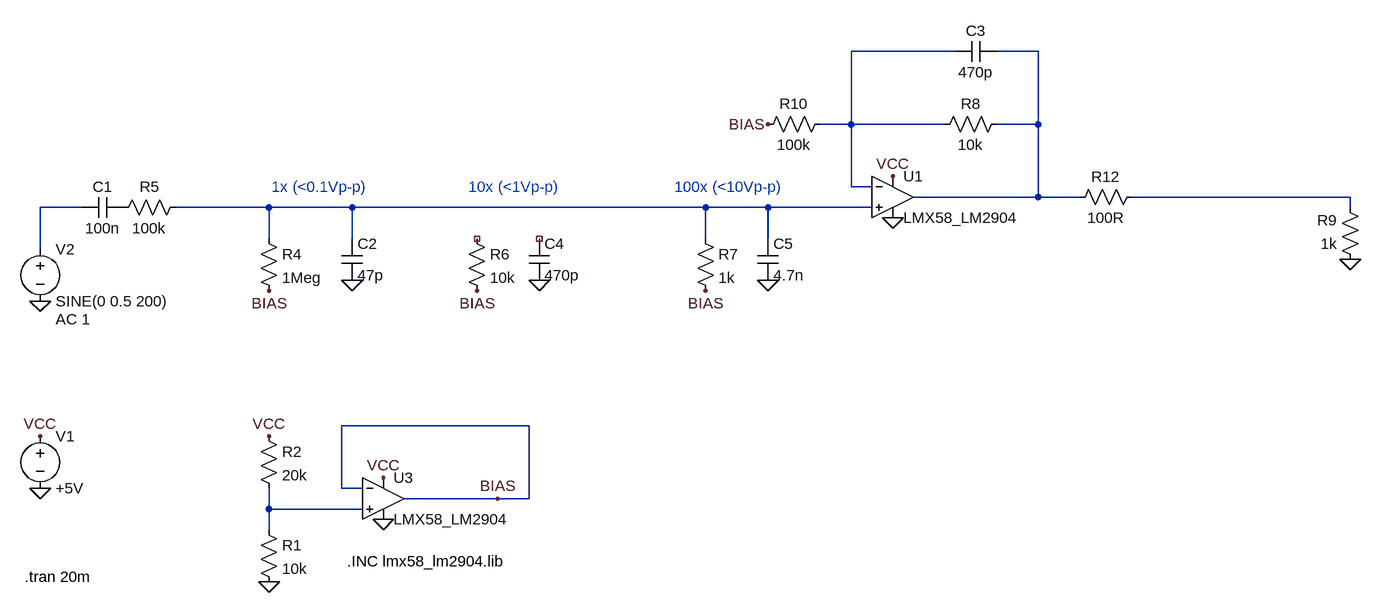
[diagram p0: schematic osciloscopio.asc]
osciloscopio.asc, the LTspice schematic file:
Version 4
SHEET 1 2564 696
WIRE 1344 -384 1184 -384
WIRE 1472 -384 1408 -384
WIRE 1184 -272 1184 -384
WIRE 1184 -272 1136 -272
WIRE 1328 -272 1184 -272
WIRE 1472 -272 1472 -384
WIRE 1472 -272 1408 -272
WIRE 1184 -176 1184 -272
WIRE 1216 -176 1184 -176
WIRE 1472 -160 1472 -272
WIRE 1472 -160 1280 -160
WIRE 1536 -160 1472 -160
WIRE 1952 -160 1616 -160
WIRE 0 -144 -64 -144
WIRE 288 -144 144 -144
WIRE 416 -144 288 -144
WIRE 960 -144 416 -144
WIRE 1056 -144 960 -144
WIRE 1216 -144 1056 -144
WIRE 1952 -144 1952 -160
WIRE 288 -96 288 -144
WIRE 416 -96 416 -144
WIRE 960 -96 960 -144
WIRE 1056 -96 1056 -144
WIRE -64 -80 -64 -144
WIRE 688 192 400 192
WIRE 400 288 400 192
WIRE 432 288 400 288
WIRE 640 304 496 304
WIRE 688 304 688 192
WIRE 688 304 640 304
WIRE 288 320 288 288
WIRE 432 320 288 320
WIRE 288 352 288 320
FLAG -64 0 0
FLAG 1952 -64 0
FLAG -64 288 0
FLAG -64 208 VCC
FLAG 1248 -192 VCC
FLAG 1248 -128 0
FLAG 288 432 0
FLAG 288 208 VCC
FLAG 464 272 VCC
FLAG 464 336 0
FLAG 640 304 BIAS
FLAG 288 -16 BIAS
FLAG 608 -16 BIAS
FLAG 960 -16 BIAS
FLAG 1056 -272 BIAS
FLAG 416 -32 0
FLAG 704 -32 0
FLAG 1056 -32 0
SYMBOL res 48 -128 R270
WINDOW 0 32 56 VTop 2
WINDOW 3 0 56 VBottom 2
SYMATTR InstName R5
SYMATTR Value 100k
SYMBOL voltage -64 -96 R0
WINDOW 123 24 124 Left 2
WINDOW 39 24 152 Left 2
SYMATTR Value2 AC 1
SYMATTR InstName V2
SYMATTR Value SINE(0 0.5 200)
SYMBOL res 1968 -48 R180
WINDOW 0 36 76 Left 2
WINDOW 3 36 40 Left 2
SYMATTR InstName R9
SYMATTR Value 1k
SYMBOL voltage -64 192 R0
WINDOW 123 0 0 Left 0
WINDOW 39 0 0 Left 0
SYMATTR InstName V1
SYMATTR Value +5V
SYMBOL cap 64 -160 R90
WINDOW 0 0 32 VBottom 2
WINDOW 3 32 32 VTop 2
SYMATTR InstName C1
SYMATTR Value 100n
SYMBOL OpAmps\\opamp2 1248 -224 R0
SYMATTR InstName U1
SYMATTR Value LMX58_LM2904
SYMBOL res 272 336 R0
SYMATTR InstName R1
SYMATTR Value 10k
SYMBOL res 272 192 R0
SYMATTR InstName R2
SYMATTR Value 20k
SYMBOL OpAmps\\opamp2 464 240 R0
SYMATTR InstName U3
SYMATTR Value LMX58_LM2904
SYMBOL res 272 -112 R0
SYMATTR InstName R4
SYMATTR Value 1Meg
SYMBOL res 592 -112 R0
SYMATTR InstName R6
SYMATTR Value 10k
SYMBOL res 944 -112 R0
SYMATTR InstName R7
SYMATTR Value 1k
SYMBOL res 1424 -288 R90
WINDOW 0 0 56 VBottom 2
WINDOW 3 32 56 VTop 2
SYMATTR InstName R8
SYMATTR Value 10k
SYMBOL res 1152 -288 R90
WINDOW 0 0 56 VBottom 2
WINDOW 3 32 56 VTop 2
SYMATTR InstName R10
SYMATTR Value 100k
SYMBOL cap 1408 -400 R90
WINDOW 0 0 32 VBottom 2
WINDOW 3 32 32 VTop 2
SYMATTR InstName C3
SYMATTR Value 470p
SYMBOL cap 400 -96 R0
SYMATTR InstName C2
SYMATTR Value 47p
SYMBOL cap 688 -96 R0
SYMATTR InstName C4
SYMATTR Value 470p
SYMBOL cap 1040 -96 R0
SYMATTR InstName C5
SYMATTR Value 4.7n
SYMBOL res 1632 -176 R90
WINDOW 0 0 56 VBottom 2
WINDOW 3 32 56 VTop 2
SYMATTR InstName R12
SYMATTR Value 100R
TEXT 408 400 Left 2 !.INC lmx58_lm2904.lib
TEXT -88 424 Left 2 !.tran 20m
TEXT 440 -176 Right 2 ;1x (<0.1Vp-p)
TEXT 736 -176 Right 2 ;10x (<1Vp-p)
TEXT 912 -176 Left 2 ;100x (<10Vp-p)

The netlist it stands for:
* osciloscopio.asc
R5 P001 N005 100k
V2 N004 0 SINE(0 0.5 200) AC 1
R9 0 N003 1k
V1 VCC 0 +5V
C1 P001 N004 100n
XU1 N005 N001 VCC 0 N002 LMX58_LM2904  ; pins In+ In- V+ V- OUT
R1 N006 0 10k
R2 VCC N006 20k
XU3 N006 BIAS VCC 0 BIAS LMX58_LM2904  ; pins In+ In- V+ V- OUT
R4 N005 BIAS 1Meg
R6 NC_01 BIAS 10k
R7 N005 BIAS 1k
R8 N002 N001 10k
R10 N001 BIAS 100k
C3 N002 N001 470p
C2 N005 0 47p
C4 NC_02 0 470p
C5 N005 0 4.7n
R12 N003 N002 100R
.INC lmx58_lm2904.lib
.tran 20m
* 1x (<0.1Vp-p)
* 10x (<1Vp-p)
* 100x (<10Vp-p)
.backanno
.end